# EAGLE design ExpBoard (EAGLE 6.4)
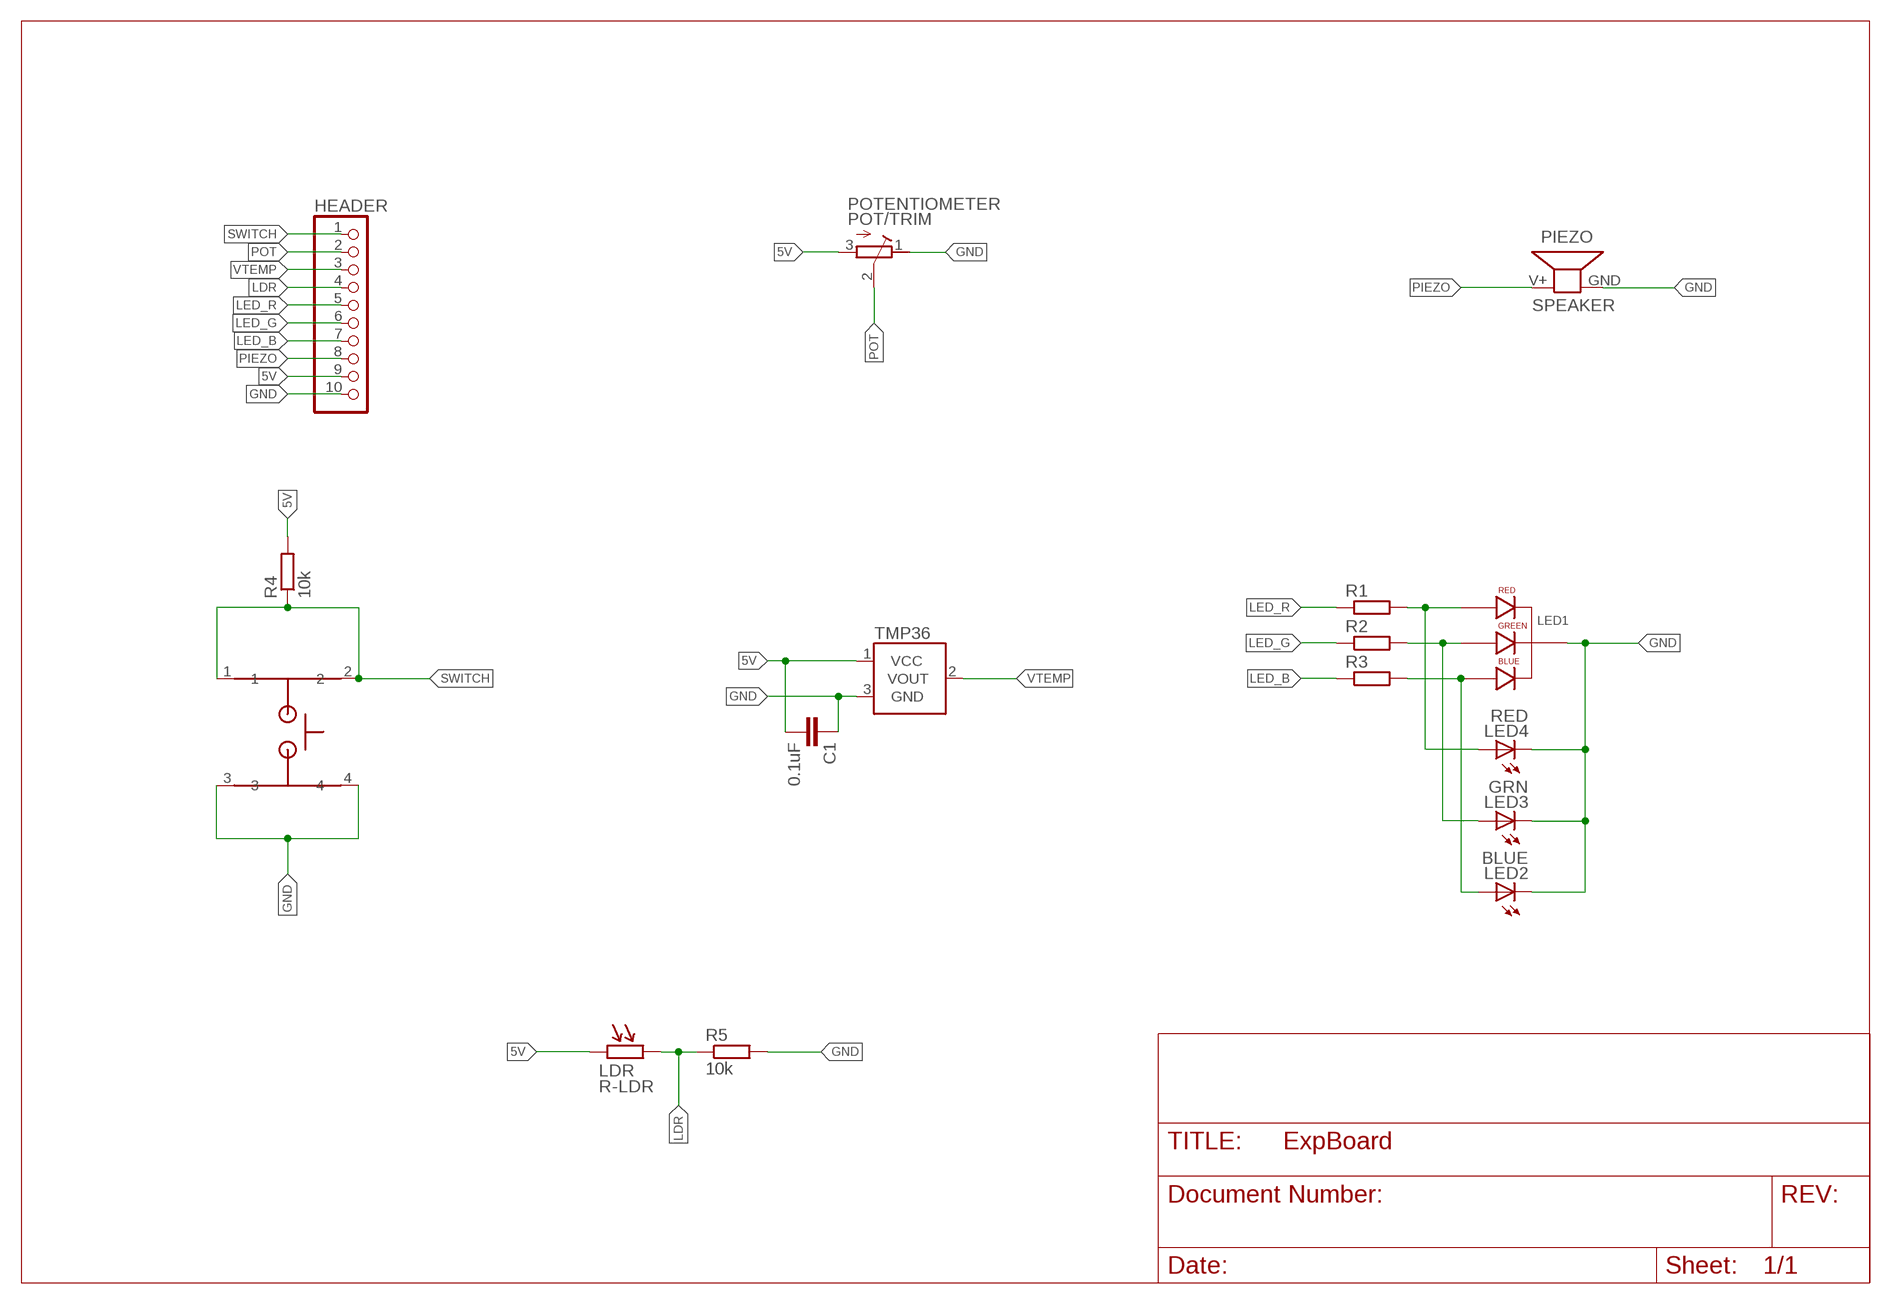
[diagram p0: schematic, sheet 1]

## Parts
C1  0.1uF  C-EU050-035X075  [C050-035X075]
HEADER  PINHD-1X10  [1X10]
LDR  R-LDR  [LDR_RE04698]
LED1  LED  [LED-RGB-TH]
LED2  BLUE  LED5MM  [LED5MM]
LED3  GRN  LED5MM  [LED5MM]
LED4  RED  LED5MM  [LED5MM]
PIEZO  SPEAKER  [PIEZO_LS03781]
POTENTIOMETER  POT/TRIM  [TRIM_RE06540]
R1  R-EU_0204/7  [0204/7]
R2  R-EU_0204/7  [0204/7]
R3  R-EU_0204/7  [0204/7]
R4  10k  R-EU_0204/7  [0204/7]
R5  10k  R-EU_0204/7  [0204/7]
SWITCH  SWITCH  [SKHHAMA010]
TMP36  TMP36GT9  [TO-92]

## Nets
5V: C1.2 HEADER.9 LDR.1 POTENTIOMETER.3(E) R4.2 TMP36.1(VCC)
GND: C1.1 HEADER.10 LED1.3(CATHODE) LED2.K(C) LED3.K(C) LED4.K(C) PIEZO.GND POTENTIOMETER.1(A) R5.2 SWITCH.3 SWITCH.4 TMP36.3(GND)
LDR: HEADER.4 LDR.2 R5.1
LED_B: HEADER.7 R3.1
LED_G: HEADER.6 R2.1
LED_R: HEADER.5 R1.1
N$2: LED1.4(RED_ANODE) LED4.A R1.2
N$3: LED1.2(GREEN_ANODE) LED3.A R2.2
N$4: LED1.1(BLUE_ANODE) LED2.A R3.2
PIEZO: HEADER.8 PIEZO.V+
POT: HEADER.2 POTENTIOMETER.2(S)
SWITCH: HEADER.1 R4.1 SWITCH.1 SWITCH.2
VTEMP: HEADER.3 TMP36.2(VOUT)

## Library data of the parts
C1 = resistor:C-EU: CAPACITOR, European symbol
HEADER = pinhead:PINHD-1X10: PIN HEADER
LDR = mjholmes:R-LDR
LED1 = mjholmes:LED
LED2-LED4 = adafruit:LED: LED OSRAM: - CHIPLED LG R971, LG N971, LY N971, LG Q971, LY Q971, LO R971, LY R971 LH N974, LH R974 LS Q976, LO Q976, LY Q976 LO Q996 - Hyper CHIPLED LW Q18S LB Q993, LB Q99A, LB R99A - SideLED LS A670, LO A670, LY A670, LG A670, LP A670 LB A673, LV A673, LT A673, LW A673 LH A674 LY A675 LS A676, LA A676, LO A676, LY A676, LW A676 LS A679, LY A679, LG A679 - Hyper Micro SIDELED® LS Y876, LA Y876, LO Y876, LY Y876 LT Y87S - SmartLED LW L88C, LW L88S LB L89C, LB L89S, LG L890 LS L89K, LO L89K, LY L89K LS L896, LA L896, LO L896, LY L896 - TOPLED LS T670, LO T670, LY T670, LG T670, LP T670 LSG T670, LSP T670, LSY T670, LOP T670, LYG T670 LG T671, LOG T671, LSG T671 LB T673, LV T673, LT T673, LW T673 LH T674 LS T676, LA T676, LO T676, LY T676, LB T676, LH T676, LSB T676, LW T676 LB T67C, LV T67C, LT T67C, LS T67K, LO T67K, LY T67K, LW E67C LS E67B, LA E67B, LO E67B, LY E67B, LB E67C, LV E67C, LT E67C LW T67C LS T679, LY T679, LG T679 LS T770, LO T770, LY T770, LG T770, LP T770 LB T773, LV T773, LT T773, LW T773 LH T774 LS E675, LA E675, LY E675, LS T675 LS T776, LA T776, LO T776, LY T776, LB T776 LHGB T686 LT T68C, LB T68C - Hyper Mini TOPLED® LB M676 - Mini TOPLED Santana® LG M470 LS M47K, LO M47K, LY M47K Source: http://www.osram.convergy.de/
PIEZO = mjholmes:SPEAKER: Various loudspeakers
POTENTIOMETER = mjholmes:POT/TRIM
R1-R5 = resistor:R-EU_: RESISTOR, European symbol
SWITCH = mjholmes:SWITCH: SWITCH, tactile, PCB mount
TMP36 = SparkFun-Sensors:TMP36: Precision degC temp sensor, analog out

## Board
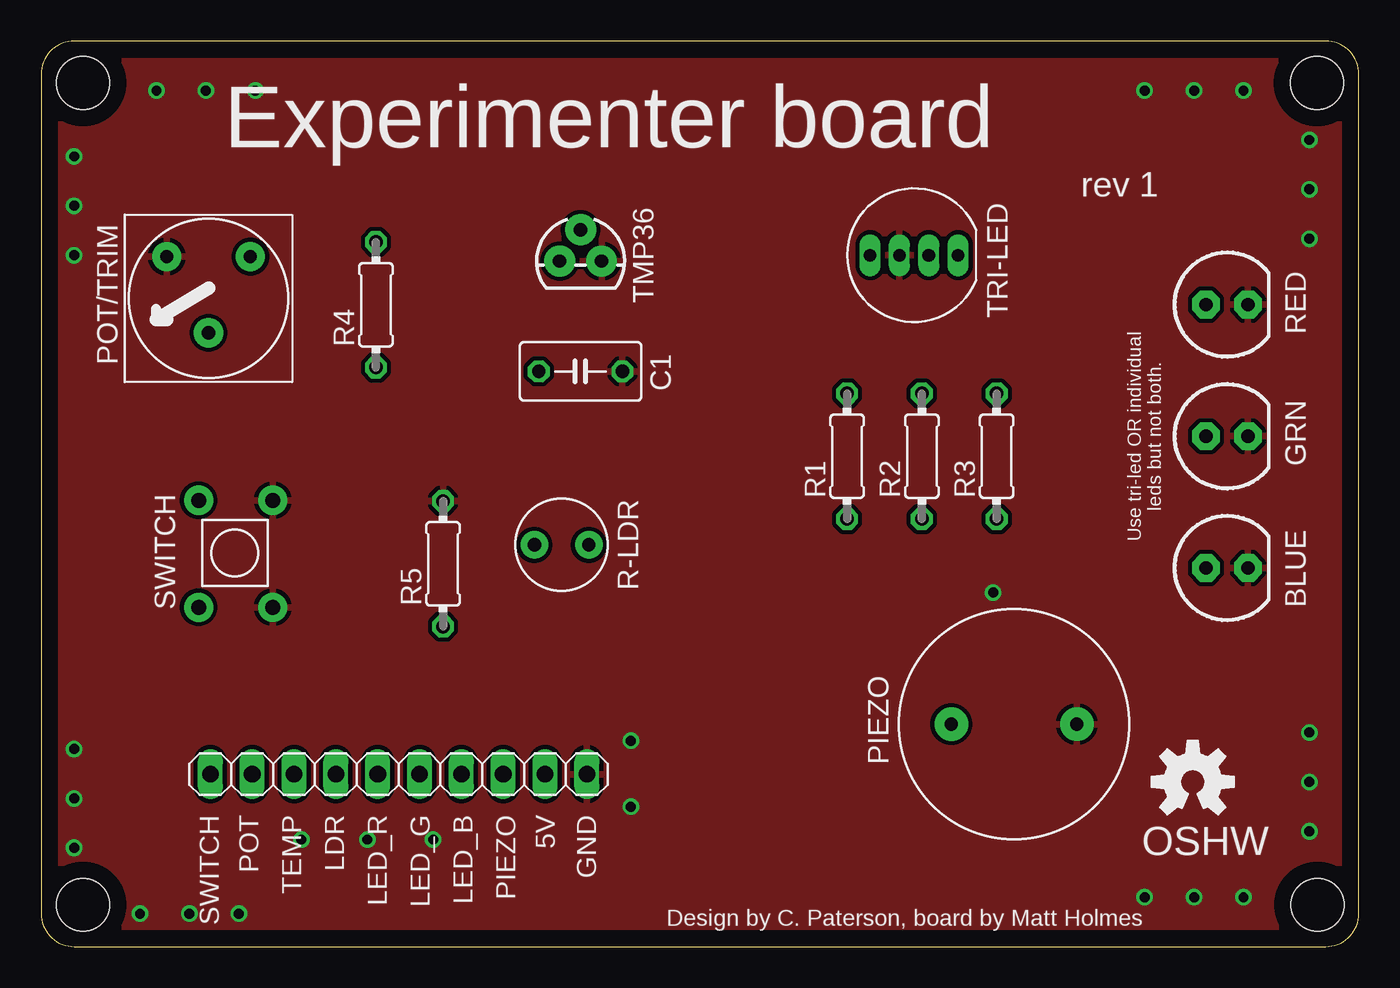
[diagram p1: board, top side]
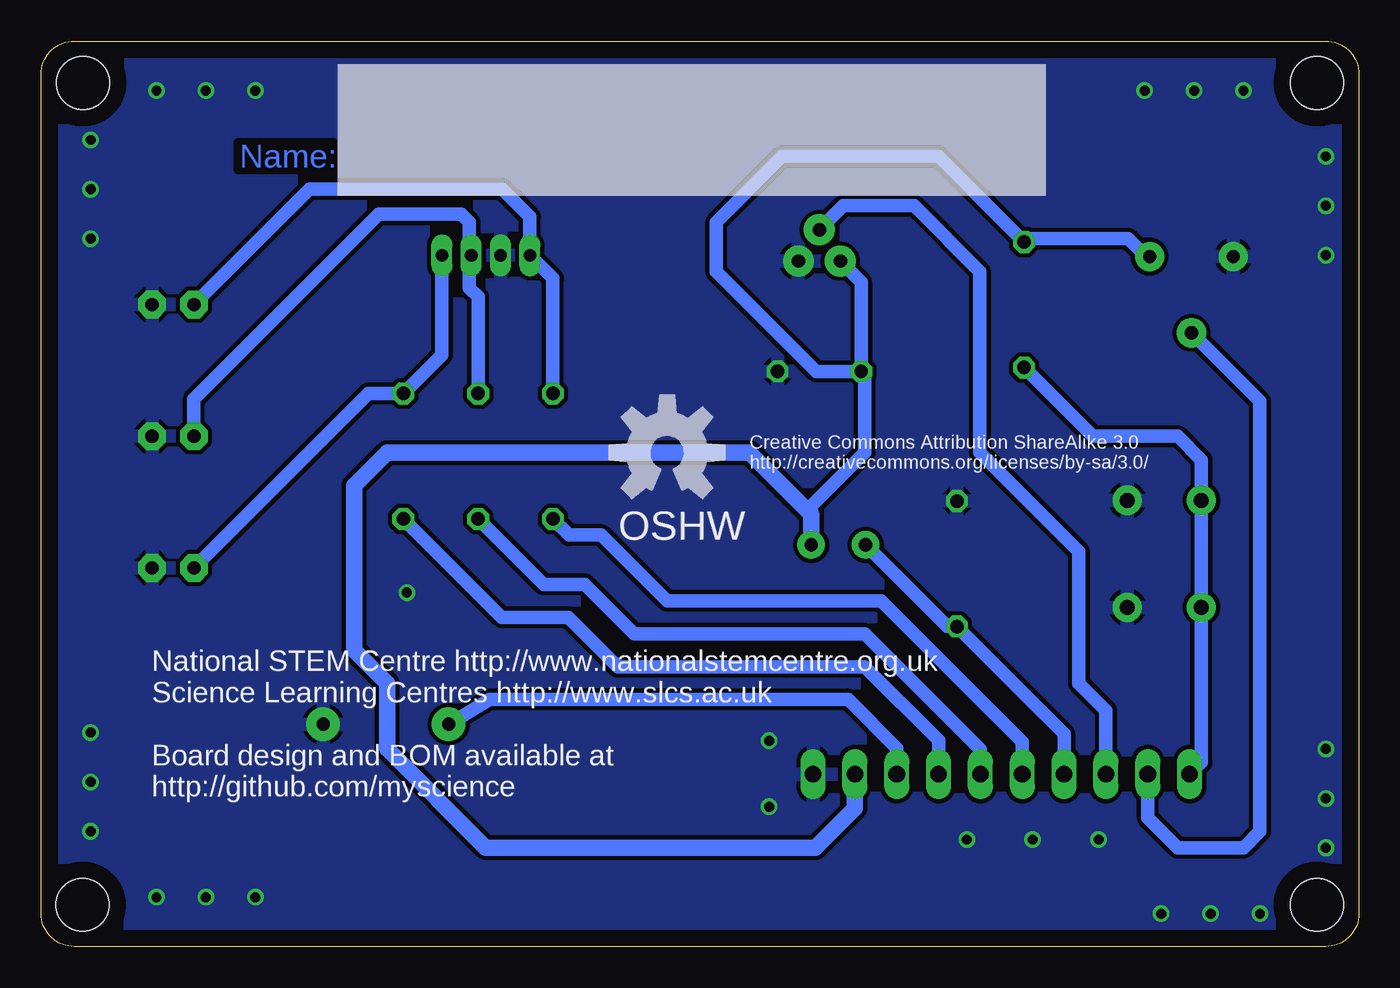
[diagram p2: board, bottom side, seen from below]

Size 80 x 55 mm. Coordinates in mm from the lower left corner, seen from the top.
Outline: 0,53 0,2 arc90 2,0 78,0 arc90 80,2 80,53 arc90 78,55 2,55 arc90 0,53
Copper layers (1*16): Top 0.035mm / dielectric 1.5mm / Bottom 0.035mm
Design rules "default *": minimum track width 20mil, minimum drill 24mil, track to track 10mil, track to pad 8mil, pad to pad 8mil, via to via 8mil, smd to smd 8mil, copper to edge 40mil, drill to drill 8mil, minimum pad ring 10mil, minimum via ring 8mil, stop-mask expansion 4mil, vias tented up to drill 0.6mm, thermal gap 10mil
Holes 3.2 mm at 2.54,52.46 77.46,52.46 77.49,2.54 2.54,2.54
bRestrict: area 62.3,47.1 to 68.1,48.9

### Footprints (pad centres in the part's own frame; a part is rotated, then mirrored left to right if it is on the bottom)
C050-035X075 = drill 0.813 octagon: 1 -2.54,0; 2 2.54,0
1X10 = drill 1.016 long: 1 -11.43,0; 2 -8.89,0; 3 -6.35,0; 4 -3.81,0; 5 -1.27,0; 6 1.27,0; 7 3.81,0; 8 6.35,0; 9 8.89,0; 10 11.43,0
LDR_RE04698 = drill 0.8 pad 1.676: 1 0,0; 2 3.302,0
LED-RGB-TH = drill 0.762 pad 1.016 long: 1 2.667,0; 2 0.889,0; 3 -0.889,0; 4 -2.667,0
LED5MM = drill 0.813 pad 1.676 octagon: A -1.27,0; K 1.27,0
PIEZO_LS03781 = drill 0.8 pad 2.032: GND 3.81,0; V+ -3.81,0
TRIM_RE06540 = drill 0.8 pad 1.778: 1 -2.54,1.27; 2 0,-3.353; 3 2.54,1.27
0204/7 = drill 0.813 octagon: 1 -3.81,0; 2 3.81,0
SKHHAMA010 = drill 0.9 pad 1.778: 1 -3,2; 2 3.5,2; 3 -3,-2.5; 4 3.5,-2.5
TO-92 = drill 0.813 pad 1.88: 1 -1.27,0; 2 0,1.905; 3 1.27,0

### Placement (x,y rotation side)
C1  32.75,34.94 180 top
HEADER  21.7,10.47 0 top
LDR  33.25,24.41 180 top
LED1  53,42 0 top
LED2  72,23 0 top
LED3  72,31 0 top
LED4  72,39 0 top
PIEZO  59.07,13.51 0 top
POTENTIOMETER  10.16,40.64 0 top
R1  48.93,29.79 90 top
R2  53.47,29.79 90 top
R3  58.01,29.79 90 top
R4  20.32,38.99 90 top
R5  24.4,23.25 90 top
SWITCH  11.56,23.61 90 top
TMP36  32.75,41.64 0 top
U$1  [OSHW-LOGO-M]  69.92,10 0 top
U$2  [OSHW-LOGO-L]  42,30 0 top

### Tracks (layer width: path | path; a pad name or v marks a point on that pad's centre or on a via)
5V
  Bottom 0.813: TMP36.1 30.21,40.37 C1.2 | C1.2 32.94,34.94 39,41 39,44 35,48 25.53,48 R4.2 20,43 14,43 13,42 POTENTIOMETER.3 | LDR.1 33.25,26.75 30,30 30,34.73 C1.2
  Bottom 1.016: HEADER.9 30.59,8.41 33,6 53,6 59,12 59,16 61,18 61,28 59,30 37,30 33.25,26.25 LDR.1
GND  (via drill 0.6)
  other vias: 2,48 2,45 2,42 2,12 2,9 2,6 6,2 9,2 12,2 67,3 70,3 70,52 67,52 13,52 10,52 7,52 15.8,6.5 19.8,6.5 23.8,6.5 57.8,21.5 35.8,8.5 35.8,12.5 73,52 77,49 77,46 77,43 73,3 77,7 77,10 77,13
  pour Top (isolate 0.254): 0,0 0,55 80,55 80,0
  pour Bottom (isolate 0.254): 0,55 80,55 80,0 0,0
LDR
  Bottom 0.813: HEADER.4 17.89,12.93 R5.1 24.98,19.44 LDR.2
LED_B
  Bottom 0.813: HEADER.7 25.51,12.51 30,17 45,17 48,20 52.03,20 R3.1
LED_G
  Bottom 0.813: HEADER.6 22.97,11.97 30,19 44,19 47,22 49.49,22 R2.1
LED_R
  Bottom 0.813: HEADER.5 20.43,12.43 29,21 42,21 46,25 47.95,25 R1.1
N$2
  Bottom 0.813: R1.2 48.93,40.6 LED1.4 50.33,44.33 52,46 63.73,46 LED4.A
N$3
  Bottom 0.813: R2.2 53.47,39.47 54,40 54,41.89 LED1.2 54,42.11 54,44 54.5,44.5 59.5,44.5 70.73,33.27 LED3.A
N$4
  Bottom 0.813: LED1.1 55.67,35.94 R3.2 60.13,33.6 LED2.A
PIEZO
  Bottom 0.813: HEADER.8 28.05,12.05 31,15 52.77,15 PIEZO.V+
POT
  Bottom 0.813: POTENTIOMETER.2 6,33.13 6,7 7,6 11,6 12.81,7.81 HEADER.2
SWITCH
  Bottom 0.813: HEADER.1 9.56,11.19 SWITCH.1 SWITCH.2 9.56,29.56 11,31 16.15,31 R4.1
VTEMP
  Bottom 0.813: TMP36.2 31.3,45 27,45 23,41 23,30 17,24 17,16 15.35,14.35 HEADER.3

### Text on the board
Bottom: Name:
tPlace: Use tri-led OR individual / leds but not both.
bPlace: Creative Commons Attribution ShareAlike 3.0 / http://creativecommons.org/licenses/by-sa/3.0/ | OSHW | National STEM Centre http://www.nationalstemcentre.org.uk / Science Learning Centres http://www.slcs.ac.uk / / Board design and BOM available at / http://github.com/myscience
tNames: Experimenter board | rev 1 | TMP36 | TRI-LED | SWITCH | POT | TEMP | LDR | LED_R | LED_G | LED_B | PIEZO | 5V | GND | OSHW | Design by C. Paterson, board by Matt Holmes